# EAGLE schematic haasoscope_pro_fpga_board - power and fanout (EAGLE 9.6.2)

## Sheet 1 of 3
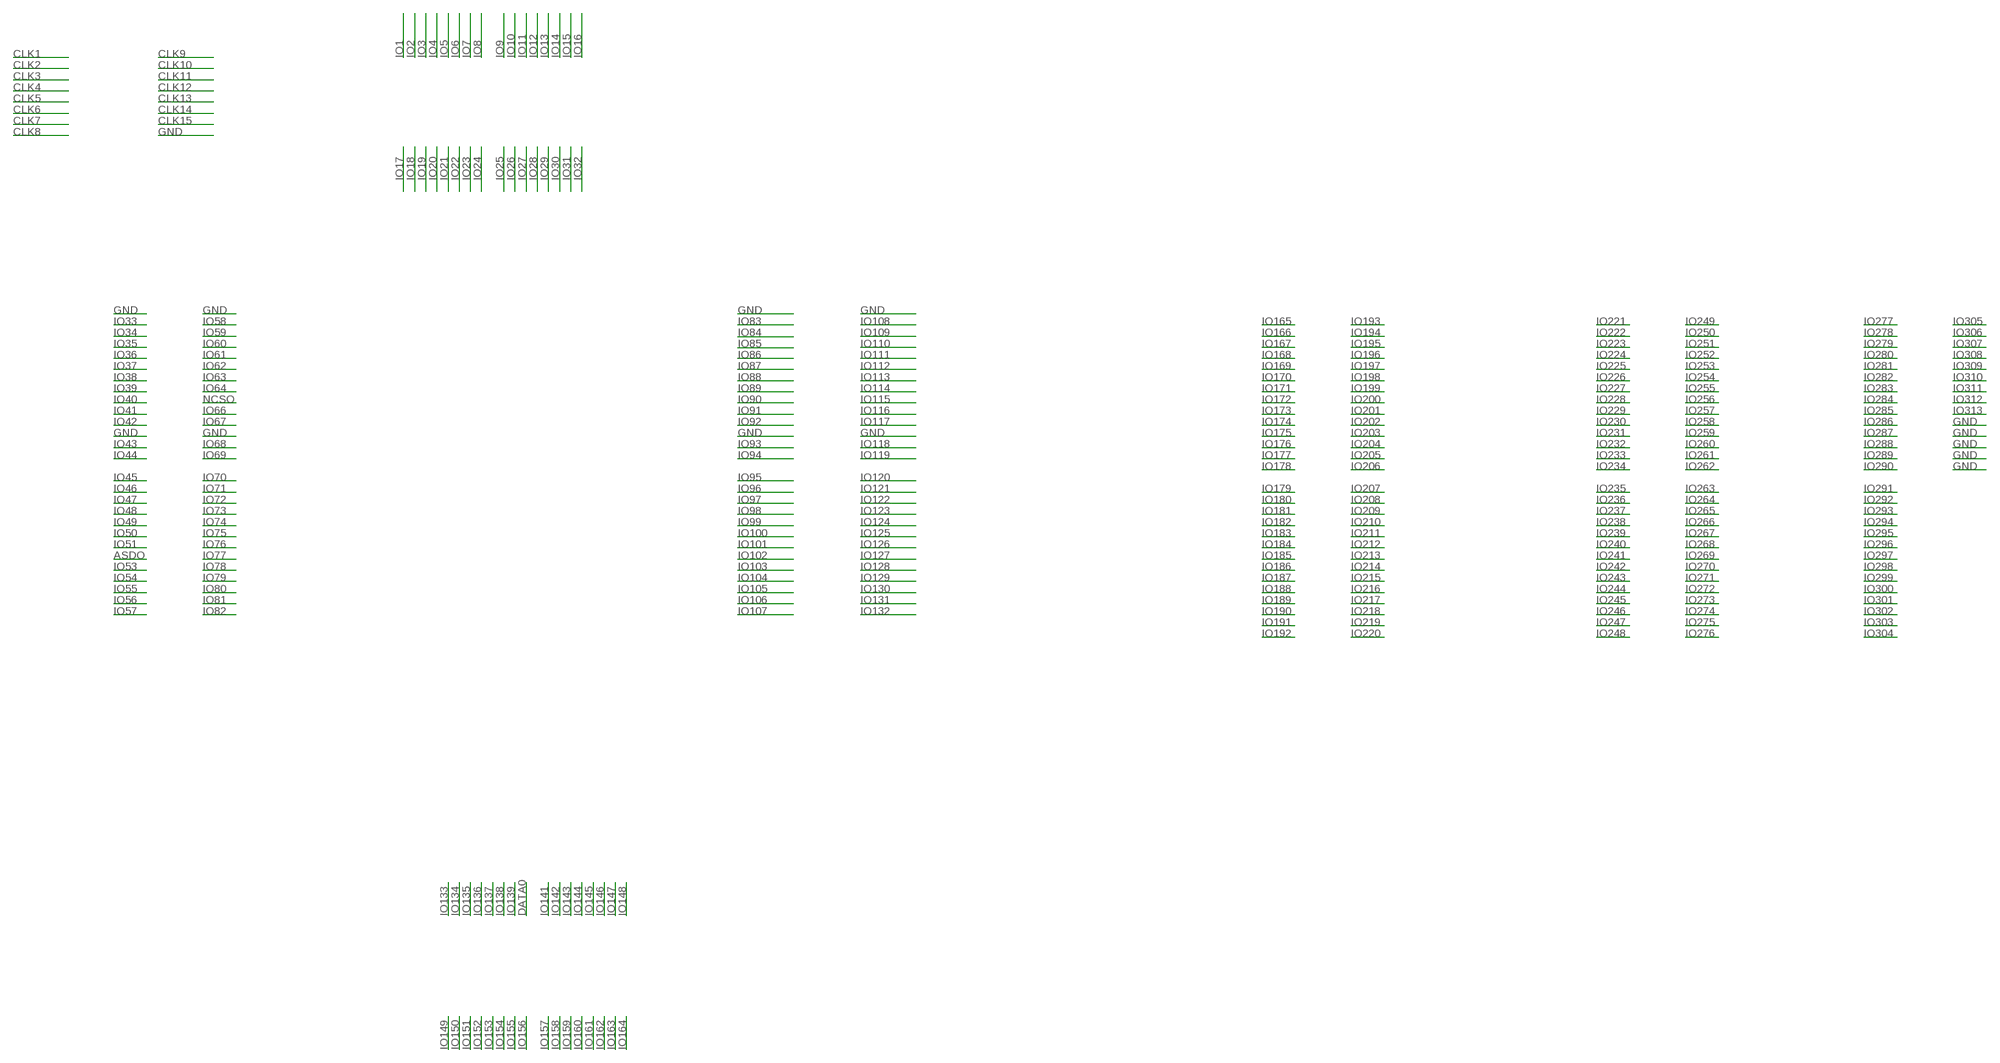
[diagram p0: schematic, sheet 1]

## Sheet 2 of 3
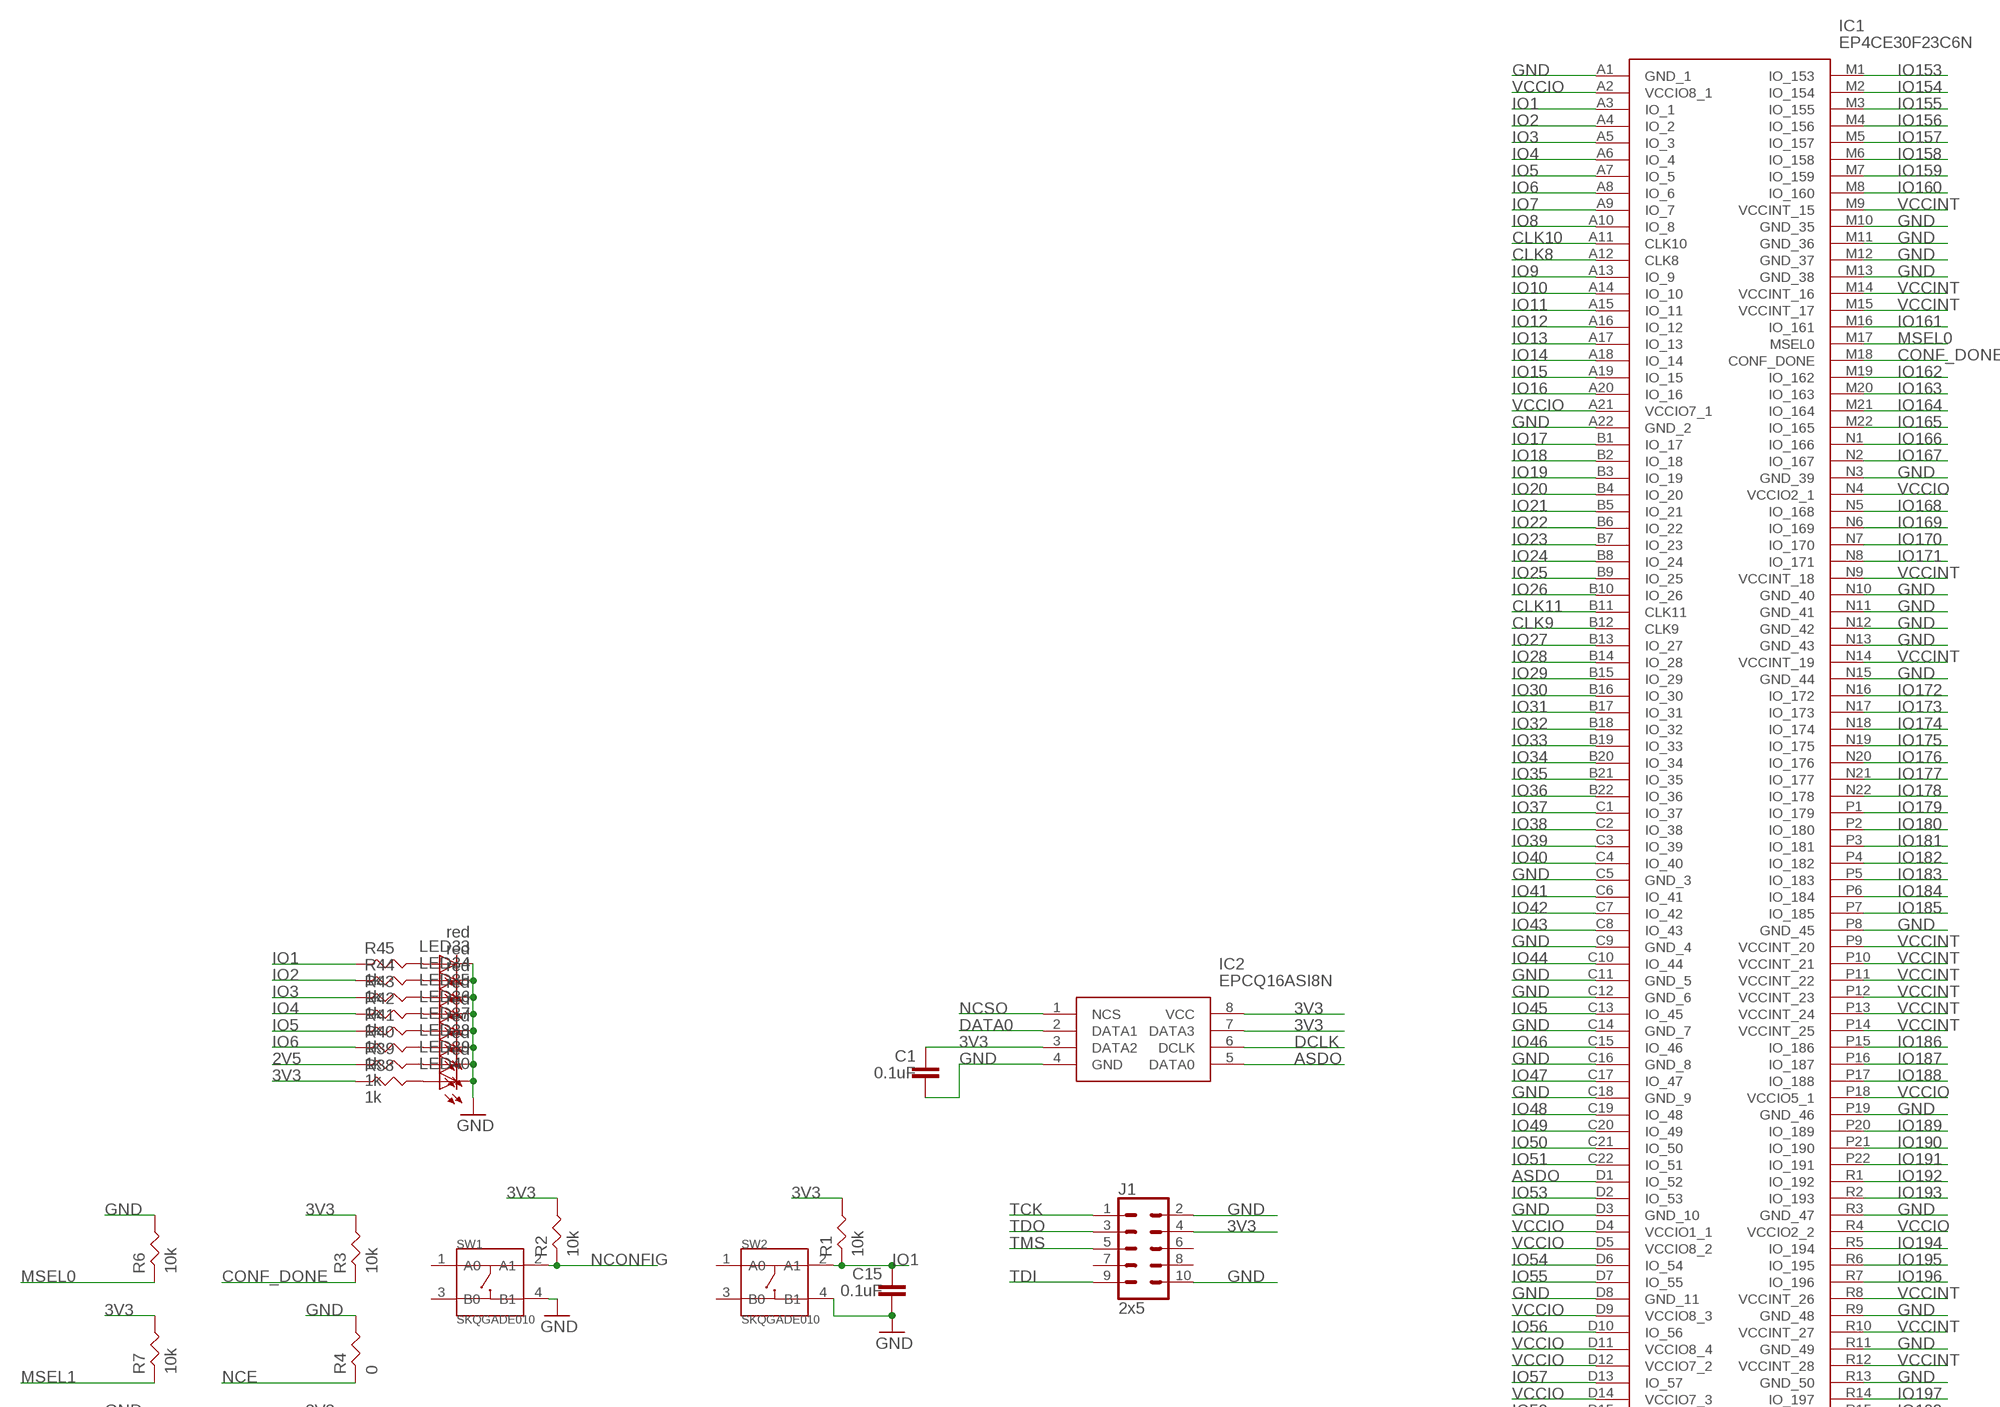
[diagram p1: schematic, sheet 2, part 1 of 2]
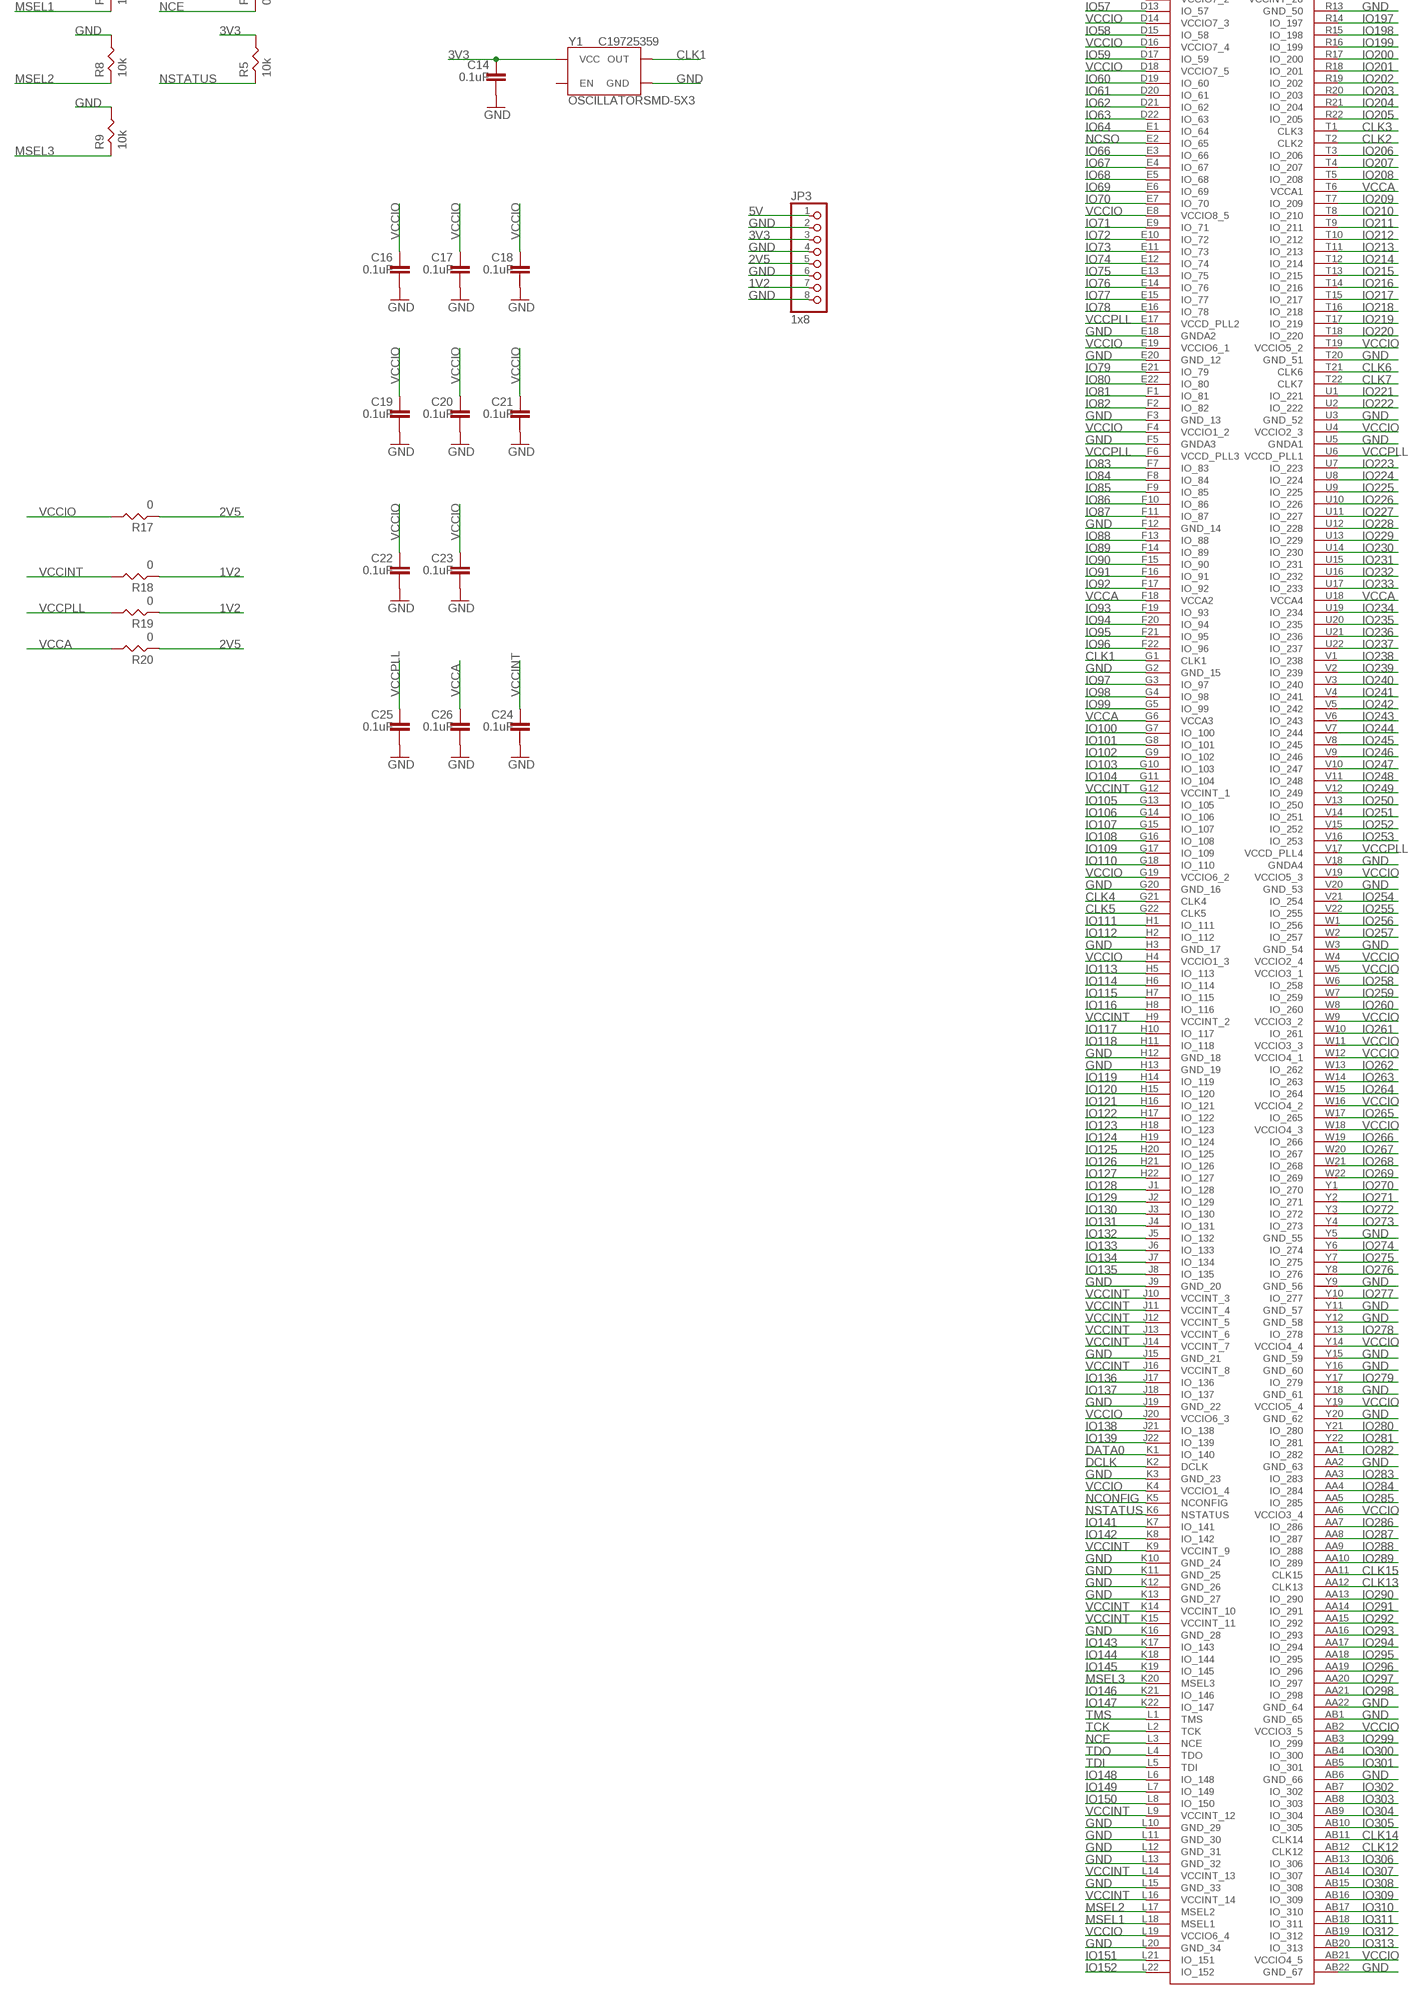
[diagram p2: schematic, sheet 2, part 2 of 2]

### Parts
C1  0.1uF  CAPACITOR_0402_N  [RESC0402_N]
C14  0.1uF  CAPACITOR_0402_N  [RESC0402_N]
C15  0.1uF  CAPACITOR_0402_N  [RESC0402_N]
C16  0.1uF  CAPACITOR_0402_N  [RESC0402_N]
C17  0.1uF  CAPACITOR_0402_N  [RESC0402_N]
C18  0.1uF  CAPACITOR_0402_N  [RESC0402_N]
C19  0.1uF  CAPACITOR_0402_N  [RESC0402_N]
C20  0.1uF  CAPACITOR_0402_N  [RESC0402_N]
C21  0.1uF  CAPACITOR_0402_N  [RESC0402_N]
C22  0.1uF  CAPACITOR_0402_N  [RESC0402_N]
C23  0.1uF  CAPACITOR_0402_N  [RESC0402_N]
C24  0.1uF  CAPACITOR_0402_N  [RESC0402_N]
C25  0.1uF  CAPACITOR_0402_N  [RESC0402_N]
C26  0.1uF  CAPACITOR_0402_N  [RESC0402_N]
IC1  EP4CE30F23C6N  [BGA484C100P22X22_2300X2300X240]
IC2  EPCQ16ASI8N  [SOIC127P600X175-8N]
J1  2x5  CONN_05X2SHD  [2X5-SHROUDED]
JP3  1x8  PINHD-1X8  [1X08]
LED33  red  LEDCHIP-LED0603  [CHIP-LED0603]
LED34  red  LEDCHIP-LED0603  [CHIP-LED0603]
LED35  red  LEDCHIP-LED0603  [CHIP-LED0603]
LED36  red  LEDCHIP-LED0603  [CHIP-LED0603]
LED37  red  LEDCHIP-LED0603  [CHIP-LED0603]
LED38  red  LEDCHIP-LED0603  [CHIP-LED0603]
LED39  red  LEDCHIP-LED0603  [CHIP-LED0603]
LED40  red  LEDCHIP-LED0603  [CHIP-LED0603]
R1  10k  RES-0402  [RES-0402]
R2  10k  RES-0402  [RES-0402]
R3  10k  RES-0402  [RES-0402]
R4  0  RES-0402  [RES-0402]
R5  10k  RES-0402  [RES-0402]
R6  10k  RES-0402  [RES-0402]
R7  10k  RES-0402  [RES-0402]
R8  10k  RES-0402  [RES-0402]
R9  10k  RES-0402  [RES-0402]
R17  0  RES-0402  [RES-0402]
R18  0  RES-0402  [RES-0402]
R19  0  RES-0402  [RES-0402]
R20  0  RES-0402  [RES-0402]
R38  1k  RES-0402  [RES-0402]
R39  1k  RES-0402  [RES-0402]
R40  1k  RES-0402  [RES-0402]
R41  1k  RES-0402  [RES-0402]
R42  1k  RES-0402  [RES-0402]
R43  1k  RES-0402  [RES-0402]
R44  1k  RES-0402  [RES-0402]
R45  1k  RES-0402  [RES-0402]
SW1  SKQGADE010  SMD-BUTTON(4P-5.2X5.2X1.5MM-SKQGADE010)-SKQGADE010  [SW4-SMD-5.2X5.2X1.5MM]
SW2  SKQGADE010  SMD-BUTTON(4P-5.2X5.2X1.5MM-SKQGADE010)-SKQGADE010  [SW4-SMD-5.2X5.2X1.5MM]
Y1  OSCILLATORSMD-5X3  [OSCILLATOR-SMD-5X3.2]

### Nets
1V2 [power]: JP3.7 R18.P$1 R19.P$1 ; also sheet 3
2V5 [power]: JP3.5 R17.P$1 R20.P$1 R39.P$1 ; also sheet 3
3V3 [power]: C1.2 C14.2 IC2.3(DATA2) IC2.7(DATA3) IC2.8(VCC) J1.4 JP3.3 R1.P$2 R2.P$2 R3.P$2 R5.P$2 R7.P$2 R38.P$1 Y1.4(VCC) ; also sheet 3
5V [power]: JP3.1 ; also sheet 3
ASDO: IC1.D1(IO_52) IC2.5(DATA0) ; also sheet 1
CLK1: IC1.G1(CLK1) Y1.3(OUT) ; also sheet 1
CLK2: IC1.T2(CLK2) ; also sheet 1
CLK3: IC1.T1(CLK3) ; also sheet 1
CLK4: IC1.G21(CLK4) ; also sheet 1
CLK5: IC1.G22(CLK5) ; also sheet 1
CLK6: IC1.T21(CLK6) ; also sheet 1
CLK7: IC1.T22(CLK7) ; also sheet 1
CLK8: IC1.A12(CLK8) ; also sheet 1
CLK9: IC1.B12(CLK9) ; also sheet 1
CLK10: IC1.A11(CLK10) ; also sheet 1
CLK11: IC1.B11(CLK11) ; also sheet 1
CLK12: IC1.AB12(CLK12) ; also sheet 1
CLK13: IC1.AA12(CLK13) ; also sheet 1
CLK14: IC1.AB11(CLK14) ; also sheet 1
CLK15: IC1.AA11(CLK15) ; also sheet 1
CONF_DONE: IC1.M18(CONF_DONE) R3.P$1
DATA0: IC1.K1(IO_140) IC2.2(DATA1) ; also sheet 1
DCLK: IC1.K2(DCLK) IC2.6(DCLK)
GND [power]: C1.1 C14.1 C15.1 C16.1 C17.1 C18.1 C19.1 C20.1 C21.1 C22.1 C23.1 C24.1 C25.1 C26.1 IC1.A1(GND_1) IC1.A22(GND_2) IC1.AA2(GND_63) IC1.AA22(GND_64) IC1.AB1(GND_65) IC1.AB6(GND_66) IC1.AB22(GND_67) IC1.C5(GND_3) IC1.C9(GND_4) IC1.C11(GND_5) IC1.C12(GND_6) IC1.C14(GND_7) IC1.C16(GND_8) IC1.C18(GND_9) IC1.D3(GND_10) IC1.D8(GND_11) IC1.E18(GNDA2) IC1.E20(GND_12) IC1.F3(GND_13) IC1.F5(GNDA3) IC1.F12(GND_14) IC1.G2(GND_15) IC1.G20(GND_16) IC1.H3(GND_17) IC1.H12(GND_18) IC1.H13(GND_19) IC1.J9(GND_20) IC1.J15(GND_21) IC1.J19(GND_22) IC1.K3(GND_23) IC1.K10(GND_24) IC1.K11(GND_25) IC1.K12(GND_26) IC1.K13(GND_27) IC1.K16(GND_28) IC1.L10(GND_29) IC1.L11(GND_30) IC1.L12(GND_31) IC1.L13(GND_32) IC1.L15(GND_33) IC1.L20(GND_34) IC1.M10(GND_35) IC1.M11(GND_36) IC1.M12(GND_37) IC1.M13(GND_38) IC1.N3(GND_39) IC1.N10(GND_40) IC1.N11(GND_41) IC1.N12(GND_42) IC1.N13(GND_43) IC1.N15(GND_44) IC1.P8(GND_45) IC1.P19(GND_46) IC1.R3(GND_47) IC1.R9(GND_48) IC1.R11(GND_49) IC1.R13(GND_50) IC1.T20(GND_51) IC1.U3(GND_52) IC1.U5(GNDA1) IC1.V18(GNDA4) IC1.V20(GND_53) IC1.W3(GND_54) IC1.Y5(GND_55) IC1.Y9(GND_56) IC1.Y11(GND_57) IC1.Y12(GND_58) IC1.Y15(GND_59) IC1.Y16(GND_60) IC1.Y18(GND_61) IC1.Y20(GND_62) IC2.4(GND) J1.2 J1.10 JP3.2 JP3.4 JP3.6 JP3.8 LED33.C LED34.C LED35.C LED36.C LED37.C LED38.C LED39.C LED40.C R4.P$2 R6.P$2 R8.P$2 R9.P$2 SW1.4(B1) SW2.4(B1) Y1.2(GND) ; also sheet 1,3
IO1: C15.2 IC1.A3(IO_1) R1.P$1 R45.P$1 SW2.2(A1) ; also sheet 1
IO2: IC1.A4(IO_2) R44.P$1 ; also sheet 1
IO3: IC1.A5(IO_3) R43.P$1 ; also sheet 1
IO4: IC1.A6(IO_4) R42.P$1 ; also sheet 1
IO5: IC1.A7(IO_5) R41.P$1 ; also sheet 1
IO6: IC1.A8(IO_6) R40.P$1 ; also sheet 1
IO7: IC1.A9(IO_7) ; also sheet 1
IO8: IC1.A10(IO_8) ; also sheet 1
IO9: IC1.A13(IO_9) ; also sheet 1
IO10: IC1.A14(IO_10) ; also sheet 1
IO11: IC1.A15(IO_11) ; also sheet 1
IO12: IC1.A16(IO_12) ; also sheet 1
IO13: IC1.A17(IO_13) ; also sheet 1
IO14: IC1.A18(IO_14) ; also sheet 1
IO15: IC1.A19(IO_15) ; also sheet 1
IO16: IC1.A20(IO_16) ; also sheet 1
IO17: IC1.B1(IO_17) ; also sheet 1
IO18: IC1.B2(IO_18) ; also sheet 1
IO19: IC1.B3(IO_19) ; also sheet 1
IO20: IC1.B4(IO_20) ; also sheet 1
IO21: IC1.B5(IO_21) ; also sheet 1
IO22: IC1.B6(IO_22) ; also sheet 1
IO23: IC1.B7(IO_23) ; also sheet 1
IO24: IC1.B8(IO_24) ; also sheet 1
IO25: IC1.B9(IO_25) ; also sheet 1
IO26: IC1.B10(IO_26) ; also sheet 1
IO27: IC1.B13(IO_27) ; also sheet 1
IO28: IC1.B14(IO_28) ; also sheet 1
IO29: IC1.B15(IO_29) ; also sheet 1
IO30: IC1.B16(IO_30) ; also sheet 1
IO31: IC1.B17(IO_31) ; also sheet 1
IO32: IC1.B18(IO_32) ; also sheet 1
IO33: IC1.B19(IO_33) ; also sheet 1
IO34: IC1.B20(IO_34) ; also sheet 1
IO35: IC1.B21(IO_35) ; also sheet 1
IO36: IC1.B22(IO_36) ; also sheet 1
IO37: IC1.C1(IO_37) ; also sheet 1
IO38: IC1.C2(IO_38) ; also sheet 1
IO39: IC1.C3(IO_39) ; also sheet 1
IO40: IC1.C4(IO_40) ; also sheet 1
IO41: IC1.C6(IO_41) ; also sheet 1
IO42: IC1.C7(IO_42) ; also sheet 1
IO43: IC1.C8(IO_43) ; also sheet 1
IO44: IC1.C10(IO_44) ; also sheet 1
IO45: IC1.C13(IO_45) ; also sheet 1
IO46: IC1.C15(IO_46) ; also sheet 1
IO47: IC1.C17(IO_47) ; also sheet 1
IO48: IC1.C19(IO_48) ; also sheet 1
IO49: IC1.C20(IO_49) ; also sheet 1
IO50: IC1.C21(IO_50) ; also sheet 1
IO51: IC1.C22(IO_51) ; also sheet 1
IO53: IC1.D2(IO_53) ; also sheet 1
IO54: IC1.D6(IO_54) ; also sheet 1
IO55: IC1.D7(IO_55) ; also sheet 1
IO56: IC1.D10(IO_56) ; also sheet 1
IO57: IC1.D13(IO_57) ; also sheet 1
IO58: IC1.D15(IO_58) ; also sheet 1
IO59: IC1.D17(IO_59) ; also sheet 1
IO60: IC1.D19(IO_60) ; also sheet 1
IO61: IC1.D20(IO_61) ; also sheet 1
IO62: IC1.D21(IO_62) ; also sheet 1
IO63: IC1.D22(IO_63) ; also sheet 1
IO64: IC1.E1(IO_64) ; also sheet 1
IO66: IC1.E3(IO_66) ; also sheet 1
IO67: IC1.E4(IO_67) ; also sheet 1
IO68: IC1.E5(IO_68) ; also sheet 1
IO69: IC1.E6(IO_69) ; also sheet 1
IO70: IC1.E7(IO_70) ; also sheet 1
IO71: IC1.E9(IO_71) ; also sheet 1
IO72: IC1.E10(IO_72) ; also sheet 1
IO73: IC1.E11(IO_73) ; also sheet 1
IO74: IC1.E12(IO_74) ; also sheet 1
IO75: IC1.E13(IO_75) ; also sheet 1
IO76: IC1.E14(IO_76) ; also sheet 1
IO77: IC1.E15(IO_77) ; also sheet 1
IO78: IC1.E16(IO_78) ; also sheet 1
IO79: IC1.E21(IO_79) ; also sheet 1
IO80: IC1.E22(IO_80) ; also sheet 1
IO81: IC1.F1(IO_81) ; also sheet 1
IO82: IC1.F2(IO_82) ; also sheet 1
IO83: IC1.F7(IO_83) ; also sheet 1
IO84: IC1.F8(IO_84) ; also sheet 1
IO85: IC1.F9(IO_85) ; also sheet 1
IO86: IC1.F10(IO_86) ; also sheet 1
IO87: IC1.F11(IO_87) ; also sheet 1
IO88: IC1.F13(IO_88) ; also sheet 1
IO89: IC1.F14(IO_89) ; also sheet 1
IO90: IC1.F15(IO_90) ; also sheet 1
IO91: IC1.F16(IO_91) ; also sheet 1
IO92: IC1.F17(IO_92) ; also sheet 1
IO93: IC1.F19(IO_93) ; also sheet 1
IO94: IC1.F20(IO_94) ; also sheet 1
IO95: IC1.F21(IO_95) ; also sheet 1
IO96: IC1.F22(IO_96) ; also sheet 1
IO97: IC1.G3(IO_97) ; also sheet 1
IO98: IC1.G4(IO_98) ; also sheet 1
IO99: IC1.G5(IO_99) ; also sheet 1
IO100: IC1.G7(IO_100) ; also sheet 1
IO101: IC1.G8(IO_101) ; also sheet 1
IO102: IC1.G9(IO_102) ; also sheet 1
IO103: IC1.G10(IO_103) ; also sheet 1
IO104: IC1.G11(IO_104) ; also sheet 1
IO105: IC1.G13(IO_105) ; also sheet 1
IO106: IC1.G14(IO_106) ; also sheet 1
IO107: IC1.G15(IO_107) ; also sheet 1
IO108: IC1.G16(IO_108) ; also sheet 1
IO109: IC1.G17(IO_109) ; also sheet 1
IO110: IC1.G18(IO_110) ; also sheet 1
IO111: IC1.H1(IO_111) ; also sheet 1
IO112: IC1.H2(IO_112) ; also sheet 1
IO113: IC1.H5(IO_113) ; also sheet 1
IO114: IC1.H6(IO_114) ; also sheet 1
IO115: IC1.H7(IO_115) ; also sheet 1
IO116: IC1.H8(IO_116) ; also sheet 1
IO117: IC1.H10(IO_117) ; also sheet 1
IO118: IC1.H11(IO_118) ; also sheet 1
IO119: IC1.H14(IO_119) ; also sheet 1
IO120: IC1.H15(IO_120) ; also sheet 1
IO121: IC1.H16(IO_121) ; also sheet 1
IO122: IC1.H17(IO_122) ; also sheet 1
IO123: IC1.H18(IO_123) ; also sheet 1
IO124: IC1.H19(IO_124) ; also sheet 1
IO125: IC1.H20(IO_125) ; also sheet 1
IO126: IC1.H21(IO_126) ; also sheet 1
IO127: IC1.H22(IO_127) ; also sheet 1
IO128: IC1.J1(IO_128) ; also sheet 1
IO129: IC1.J2(IO_129) ; also sheet 1
IO130: IC1.J3(IO_130) ; also sheet 1
IO131: IC1.J4(IO_131) ; also sheet 1
IO132: IC1.J5(IO_132) ; also sheet 1
IO133: IC1.J6(IO_133) ; also sheet 1
IO134: IC1.J7(IO_134) ; also sheet 1
IO135: IC1.J8(IO_135) ; also sheet 1
IO136: IC1.J17(IO_136) ; also sheet 1
IO137: IC1.J18(IO_137) ; also sheet 1
IO138: IC1.J21(IO_138) ; also sheet 1
IO139: IC1.J22(IO_139) ; also sheet 1
IO141: IC1.K7(IO_141) ; also sheet 1
IO142: IC1.K8(IO_142) ; also sheet 1
IO143: IC1.K17(IO_143) ; also sheet 1
IO144: IC1.K18(IO_144) ; also sheet 1
IO145: IC1.K19(IO_145) ; also sheet 1
IO146: IC1.K21(IO_146) ; also sheet 1
IO147: IC1.K22(IO_147) ; also sheet 1
IO148: IC1.L6(IO_148) ; also sheet 1
IO149: IC1.L7(IO_149) ; also sheet 1
IO150: IC1.L8(IO_150) ; also sheet 1
IO151: IC1.L21(IO_151) ; also sheet 1
IO152: IC1.L22(IO_152) ; also sheet 1
IO153: IC1.M1(IO_153) ; also sheet 1
IO154: IC1.M2(IO_154) ; also sheet 1
IO155: IC1.M3(IO_155) ; also sheet 1
IO156: IC1.M4(IO_156) ; also sheet 1
IO157: IC1.M5(IO_157) ; also sheet 1
IO158: IC1.M6(IO_158) ; also sheet 1
IO159: IC1.M7(IO_159) ; also sheet 1
IO160: IC1.M8(IO_160) ; also sheet 1
IO161: IC1.M16(IO_161) ; also sheet 1
IO162: IC1.M19(IO_162) ; also sheet 1
IO163: IC1.M20(IO_163) ; also sheet 1
IO164: IC1.M21(IO_164) ; also sheet 1
IO165: IC1.M22(IO_165) ; also sheet 1
IO166: IC1.N1(IO_166) ; also sheet 1
IO167: IC1.N2(IO_167) ; also sheet 1
IO168: IC1.N5(IO_168) ; also sheet 1
IO169: IC1.N6(IO_169) ; also sheet 1
IO170: IC1.N7(IO_170) ; also sheet 1
IO171: IC1.N8(IO_171) ; also sheet 1
IO172: IC1.N16(IO_172) ; also sheet 1
IO173: IC1.N17(IO_173) ; also sheet 1
IO174: IC1.N18(IO_174) ; also sheet 1
IO175: IC1.N19(IO_175) ; also sheet 1
IO176: IC1.N20(IO_176) ; also sheet 1
IO177: IC1.N21(IO_177) ; also sheet 1
IO178: IC1.N22(IO_178) ; also sheet 1
IO179: IC1.P1(IO_179) ; also sheet 1
IO180: IC1.P2(IO_180) ; also sheet 1
IO181: IC1.P3(IO_181) ; also sheet 1
IO182: IC1.P4(IO_182) ; also sheet 1
IO183: IC1.P5(IO_183) ; also sheet 1
IO184: IC1.P6(IO_184) ; also sheet 1
IO185: IC1.P7(IO_185) ; also sheet 1
IO186: IC1.P15(IO_186) ; also sheet 1
IO187: IC1.P16(IO_187) ; also sheet 1
IO188: IC1.P17(IO_188) ; also sheet 1
IO189: IC1.P20(IO_189) ; also sheet 1
IO190: IC1.P21(IO_190) ; also sheet 1
IO191: IC1.P22(IO_191) ; also sheet 1
IO192: IC1.R1(IO_192) ; also sheet 1
IO193: IC1.R2(IO_193) ; also sheet 1
IO194: IC1.R5(IO_194) ; also sheet 1
IO195: IC1.R6(IO_195) ; also sheet 1
IO196: IC1.R7(IO_196) ; also sheet 1
IO197: IC1.R14(IO_197) ; also sheet 1
IO198: IC1.R15(IO_198) ; also sheet 1
IO199: IC1.R16(IO_199) ; also sheet 1
IO200: IC1.R17(IO_200) ; also sheet 1
IO201: IC1.R18(IO_201) ; also sheet 1
IO202: IC1.R19(IO_202) ; also sheet 1
IO203: IC1.R20(IO_203) ; also sheet 1
IO204: IC1.R21(IO_204) ; also sheet 1
IO205: IC1.R22(IO_205) ; also sheet 1
IO206: IC1.T3(IO_206) ; also sheet 1
IO207: IC1.T4(IO_207) ; also sheet 1
IO208: IC1.T5(IO_208) ; also sheet 1
IO209: IC1.T7(IO_209) ; also sheet 1
IO210: IC1.T8(IO_210) ; also sheet 1
IO211: IC1.T9(IO_211) ; also sheet 1
IO212: IC1.T10(IO_212) ; also sheet 1
IO213: IC1.T11(IO_213) ; also sheet 1
IO214: IC1.T12(IO_214) ; also sheet 1
IO215: IC1.T13(IO_215) ; also sheet 1
IO216: IC1.T14(IO_216) ; also sheet 1
IO217: IC1.T15(IO_217) ; also sheet 1
IO218: IC1.T16(IO_218) ; also sheet 1
IO219: IC1.T17(IO_219) ; also sheet 1
IO220: IC1.T18(IO_220) ; also sheet 1
IO221: IC1.U1(IO_221) ; also sheet 1
IO222: IC1.U2(IO_222) ; also sheet 1
IO223: IC1.U7(IO_223) ; also sheet 1
IO224: IC1.U8(IO_224) ; also sheet 1
IO225: IC1.U9(IO_225) ; also sheet 1
IO226: IC1.U10(IO_226) ; also sheet 1
IO227: IC1.U11(IO_227) ; also sheet 1
IO228: IC1.U12(IO_228) ; also sheet 1
IO229: IC1.U13(IO_229) ; also sheet 1
IO230: IC1.U14(IO_230) ; also sheet 1
IO231: IC1.U15(IO_231) ; also sheet 1
IO232: IC1.U16(IO_232) ; also sheet 1
IO233: IC1.U17(IO_233) ; also sheet 1
IO234: IC1.U19(IO_234) ; also sheet 1
IO235: IC1.U20(IO_235) ; also sheet 1
IO236: IC1.U21(IO_236) ; also sheet 1
IO237: IC1.U22(IO_237) ; also sheet 1
IO238: IC1.V1(IO_238) ; also sheet 1
IO239: IC1.V2(IO_239) ; also sheet 1
IO240: IC1.V3(IO_240) ; also sheet 1
IO241: IC1.V4(IO_241) ; also sheet 1
IO242: IC1.V5(IO_242) ; also sheet 1
IO243: IC1.V6(IO_243) ; also sheet 1
IO244: IC1.V7(IO_244) ; also sheet 1
IO245: IC1.V8(IO_245) ; also sheet 1
IO246: IC1.V9(IO_246) ; also sheet 1
IO247: IC1.V10(IO_247) ; also sheet 1
IO248: IC1.V11(IO_248) ; also sheet 1
IO249: IC1.V12(IO_249) ; also sheet 1
IO250: IC1.V13(IO_250) ; also sheet 1
IO251: IC1.V14(IO_251) ; also sheet 1
IO252: IC1.V15(IO_252) ; also sheet 1
IO253: IC1.V16(IO_253) ; also sheet 1
IO254: IC1.V21(IO_254) ; also sheet 1
IO255: IC1.V22(IO_255) ; also sheet 1
IO256: IC1.W1(IO_256) ; also sheet 1
IO257: IC1.W2(IO_257) ; also sheet 1
IO258: IC1.W6(IO_258) ; also sheet 1
IO259: IC1.W7(IO_259) ; also sheet 1
IO260: IC1.W8(IO_260) ; also sheet 1
IO261: IC1.W10(IO_261) ; also sheet 1
IO262: IC1.W13(IO_262) ; also sheet 1
IO263: IC1.W14(IO_263) ; also sheet 1
IO264: IC1.W15(IO_264) ; also sheet 1
IO265: IC1.W17(IO_265) ; also sheet 1
IO266: IC1.W19(IO_266) ; also sheet 1
IO267: IC1.W20(IO_267) ; also sheet 1
IO268: IC1.W21(IO_268) ; also sheet 1
IO269: IC1.W22(IO_269) ; also sheet 1
IO270: IC1.Y1(IO_270) ; also sheet 1
IO271: IC1.Y2(IO_271) ; also sheet 1
IO272: IC1.Y3(IO_272) ; also sheet 1
IO273: IC1.Y4(IO_273) ; also sheet 1
IO274: IC1.Y6(IO_274) ; also sheet 1
IO275: IC1.Y7(IO_275) ; also sheet 1
IO276: IC1.Y8(IO_276) ; also sheet 1
IO277: IC1.Y10(IO_277) ; also sheet 1
IO278: IC1.Y13(IO_278) ; also sheet 1
IO279: IC1.Y17(IO_279) ; also sheet 1
IO280: IC1.Y21(IO_280) ; also sheet 1
IO281: IC1.Y22(IO_281) ; also sheet 1
IO282: IC1.AA1(IO_282) ; also sheet 1
IO283: IC1.AA3(IO_283) ; also sheet 1
IO284: IC1.AA4(IO_284) ; also sheet 1
IO285: IC1.AA5(IO_285) ; also sheet 1
IO286: IC1.AA7(IO_286) ; also sheet 1
IO287: IC1.AA8(IO_287) ; also sheet 1
IO288: IC1.AA9(IO_288) ; also sheet 1
IO289: IC1.AA10(IO_289) ; also sheet 1
IO290: IC1.AA13(IO_290) ; also sheet 1
IO291: IC1.AA14(IO_291) ; also sheet 1
IO292: IC1.AA15(IO_292) ; also sheet 1
IO293: IC1.AA16(IO_293) ; also sheet 1
IO294: IC1.AA17(IO_294) ; also sheet 1
IO295: IC1.AA18(IO_295) ; also sheet 1
IO296: IC1.AA19(IO_296) ; also sheet 1
IO297: IC1.AA20(IO_297) ; also sheet 1
IO298: IC1.AA21(IO_298) ; also sheet 1
IO299: IC1.AB3(IO_299) ; also sheet 1
IO300: IC1.AB4(IO_300) ; also sheet 1
IO301: IC1.AB5(IO_301) ; also sheet 1
IO302: IC1.AB7(IO_302) ; also sheet 1
IO303: IC1.AB8(IO_303) ; also sheet 1
IO304: IC1.AB9(IO_304) ; also sheet 1
IO305: IC1.AB10(IO_305) ; also sheet 1
IO306: IC1.AB13(IO_306) ; also sheet 1
IO307: IC1.AB14(IO_307) ; also sheet 1
IO308: IC1.AB15(IO_308) ; also sheet 1
IO309: IC1.AB16(IO_309) ; also sheet 1
IO310: IC1.AB17(IO_310) ; also sheet 1
IO311: IC1.AB18(IO_311) ; also sheet 1
IO312: IC1.AB19(IO_312) ; also sheet 1
IO313: IC1.AB20(IO_313) ; also sheet 1
MSEL0: IC1.M17(MSEL0) R6.P$1
MSEL1: IC1.L18(MSEL1) R7.P$1
MSEL2: IC1.L17(MSEL2) R8.P$1
MSEL3: IC1.K20(MSEL3) R9.P$1
N$33: LED33.A R45.P$2
N$34: LED34.A R44.P$2
N$35: LED35.A R43.P$2
N$36: LED36.A R42.P$2
N$37: LED37.A R41.P$2
N$38: LED38.A R40.P$2
N$39: LED39.A R39.P$2
N$40: LED40.A R38.P$2
NCE: IC1.L3(NCE) R4.P$1
NCONFIG: IC1.K5(NCONFIG) R2.P$1 SW1.2(A1)
NCSO: IC1.E2(IO_65) IC2.1(NCS) ; also sheet 1
NSTATUS: IC1.K6(NSTATUS) R5.P$1
TCK: IC1.L2(TCK) J1.1
TDI: IC1.L5(TDI) J1.9
TDO: IC1.L4(TDO) J1.3
TMS: IC1.L1(TMS) J1.5
VCCA [power]: C26.2 IC1.F18(VCCA2) IC1.G6(VCCA3) IC1.T6(VCCA1) IC1.U18(VCCA4) R20.P$2
VCCINT [power]: C24.2 IC1.G12(VCCINT_1) IC1.H9(VCCINT_2) IC1.J10(VCCINT_3) IC1.J11(VCCINT_4) IC1.J12(VCCINT_5) IC1.J13(VCCINT_6) IC1.J14(VCCINT_7) IC1.J16(VCCINT_8) IC1.K9(VCCINT_9) IC1.K14(VCCINT_10) IC1.K15(VCCINT_11) IC1.L9(VCCINT_12) IC1.L14(VCCINT_13) IC1.L16(VCCINT_14) IC1.M9(VCCINT_15) IC1.M14(VCCINT_16) IC1.M15(VCCINT_17) IC1.N9(VCCINT_18) IC1.N14(VCCINT_19) IC1.P9(VCCINT_20) IC1.P10(VCCINT_21) IC1.P11(VCCINT_22) IC1.P12(VCCINT_23) IC1.P13(VCCINT_24) IC1.P14(VCCINT_25) IC1.R8(VCCINT_26) IC1.R10(VCCINT_27) IC1.R12(VCCINT_28) R18.P$2
VCCIO: C16.2 C17.2 C18.2 C19.2 C20.2 C21.2 C22.2 C23.2 IC1.A2(VCCIO8_1) IC1.A21(VCCIO7_1) IC1.AA6(VCCIO3_4) IC1.AB2(VCCIO3_5) IC1.AB21(VCCIO4_5) IC1.D4(VCCIO1_1) IC1.D5(VCCIO8_2) IC1.D9(VCCIO8_3) IC1.D11(VCCIO8_4) IC1.D12(VCCIO7_2) IC1.D14(VCCIO7_3) IC1.D16(VCCIO7_4) IC1.D18(VCCIO7_5) IC1.E8(VCCIO8_5) IC1.E19(VCCIO6_1) IC1.F4(VCCIO1_2) IC1.G19(VCCIO6_2) IC1.H4(VCCIO1_3) IC1.J20(VCCIO6_3) IC1.K4(VCCIO1_4) IC1.L19(VCCIO6_4) IC1.N4(VCCIO2_1) IC1.P18(VCCIO5_1) IC1.R4(VCCIO2_2) IC1.T19(VCCIO5_2) IC1.U4(VCCIO2_3) IC1.V19(VCCIO5_3) IC1.W4(VCCIO2_4) IC1.W5(VCCIO3_1) IC1.W9(VCCIO3_2) IC1.W11(VCCIO3_3) IC1.W12(VCCIO4_1) IC1.W16(VCCIO4_2) IC1.W18(VCCIO4_3) IC1.Y14(VCCIO4_4) IC1.Y19(VCCIO5_4) R17.P$2
VCCPLL [power]: C25.2 IC1.E17(VCCD_PLL2) IC1.F6(VCCD_PLL3) IC1.U6(VCCD_PLL1) IC1.V17(VCCD_PLL4) R19.P$2
Unconnected: J1.6 J1.7 J1.8 SW1.1(A0) SW1.3(B0) SW2.1(A0) SW2.3(B0) Y1.1(EN)

## Sheet 3 of 3
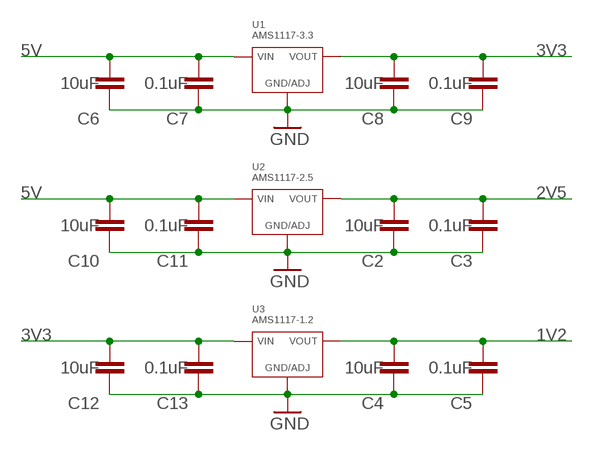
[diagram p3: schematic, sheet 3]

### Parts
C2  10uF  CAPACITOR_0805_N  [RESC0805_N]
C3  0.1uF  CAPACITOR_0402_N  [RESC0402_N]
C4  10uF  CAPACITOR_0805_N  [RESC0805_N]
C5  0.1uF  CAPACITOR_0402_N  [RESC0402_N]
C6  10uF  CAPACITOR_0805_N  [RESC0805_N]
C7  0.1uF  CAPACITOR_0402_N  [RESC0402_N]
C8  10uF  CAPACITOR_0805_N  [RESC0805_N]
C9  0.1uF  CAPACITOR_0402_N  [RESC0402_N]
C10  10uF  CAPACITOR_0805_N  [RESC0805_N]
C11  0.1uF  CAPACITOR_0402_N  [RESC0402_N]
C12  10uF  CAPACITOR_0805_N  [RESC0805_N]
C13  0.1uF  CAPACITOR_0402_N  [RESC0402_N]
U1  AMS1117-3.3  NCP1117LPST33T3G  [SOT-223-3]
U2  AMS1117-2.5  NCP1117LPST33T3G  [SOT-223-3]
U3  AMS1117-1.2  NCP1117LPST33T3G  [SOT-223-3]

### Nets
1V2 [power]: C4.2 C5.2 U3.P$1(VOUT) U3.P$3(VOUT) ; also sheet 2
2V5 [power]: C2.2 C3.2 U2.P$1(VOUT) U2.P$3(VOUT) ; also sheet 2
3V3 [power]: C8.2 C9.2 C12.2 C13.2 U1.P$1(VOUT) U1.P$3(VOUT) U3.P$4(VIN) ; also sheet 2
5V [power]: C6.2 C7.2 C10.2 C11.2 U1.P$4(VIN) U2.P$4(VIN) ; also sheet 2
GND [power]: C2.1 C3.1 C4.1 C5.1 C6.1 C7.1 C8.1 C9.1 C10.1 C11.1 C12.1 C13.1 U1.P$2(GND/ADJ) U2.P$2(GND/ADJ) U3.P$2(GND/ADJ) ; also sheet 1,2

## Library data of the parts
C1-C26 = Nordic_nRF:CAPACITOR: Generic chip capacitor
IC1 = EP4CE30F23C6N:EP4CE30F23C6N: FPGA - Field Programmable Gate Array FPGA - Cyclone IV E 1803 LABs 328 IOs Source: Datasheet; DESCRIPTION: FPGA - Field Programmable Gate Array FPGA - Cyclone IV E 1803 LABs 328 IOs; HEIGHT: 2.4mm; MANUFACTURER_NAME: Intel; MANUFACTURER_PART_NUMBER: EP4CE30F23C6N; MOUSER_PART_NUMBER: 989-EP4CE30F23C6N; MOUSER_PRICE-STOCK: https://www.mouser.co.uk/ProductDetail/Intel-Altera/EP4CE30F23C6N?qs=jblrfmjbeiFbWx2dd1mvzw%3D%3D
IC2 = EPCQ16ASI8N:EPCQ16ASI8N: FPGA - Configuration Memory Source: Datasheet <https://www.altera.com/content/dam/altera-www/global/en_US/pdfs/literature/hb/cfg/cfg_cf52014.pdf>; DESCRIPTION: FPGA - Configuration Memory; HEIGHT: 1.75mm; MANUFACTURER_NAME: Intel; MANUFACTURER_PART_NUMBER: EPCQ16ASI8N; MOUSER_PART_NUMBER: 989-EPCQ16ASI8N; MOUSER_PRICE-STOCK: https://www.mouser.co.uk/ProductDetail/Intel-Altera/EPCQ16ASI8N?qs=EU6FO9ffTwfG9ViUTMZ%252BJw%3D%3D
J1 = SparkFun-Connectors:CONN_05X2: Multi connection point. Often used as Generic Header-pin footprint for 0.1 inch spaced/style header connections For AVR SPI programming port, see special device with nice symbol: "AVR_SPI_PROG_5x2.dev" You can populate with any combo of single row headers, but if you'd like an exact match, check these: 2x5 AVR ICSP Male Header <https://www.sparkfun.com/products/778> (PRT-00778) 2x5 Pin Shrouded Header <https://www.sparkfun.com/products/8506> (PRT-08506) On any of the 0.1 inch spaced packages, you can populate with these: Break Away Headers - Straight <https://www.sparkfun.com/products/116> (PRT-00116) Break Away Male Headers - Right Angle <https://www.sparkfun.com/products/553> (PRT-00553) Female Headers <https://www.sparkfun.com/products/115> (PRT-00115) Break Away Headers - Machine Pin <https://www.sparkfun.com/products/117> (PRT-00117) Break Away Female Headers - Swiss Machine Pin <https://www.sparkfun.com/products/743> (PRT-00743) Special note: the shrouded connector mates well with our 5x2 ribbon cables: 2x5 Pin IDC Ribbon Cable <https://www.sparkfun.com/products/8535> (PRT-08535); PROD_ID: CONN-08671; SF_ID: PRT-08506
JP3 = pinhead:PINHD-1X8: PIN HEADER
LED33-LED40 = adafruit:LED: LED OSRAM: - CHIPLED LG R971, LG N971, LY N971, LG Q971, LY Q971, LO R971, LY R971 LH N974, LH R974 LS Q976, LO Q976, LY Q976 LO Q996 - Hyper CHIPLED LW Q18S LB Q993, LB Q99A, LB R99A - SideLED LS A670, LO A670, LY A670, LG A670, LP A670 LB A673, LV A673, LT A673, LW A673 LH A674 LY A675 LS A676, LA A676, LO A676, LY A676, LW A676 LS A679, LY A679, LG A679 - Hyper Micro SIDELED® LS Y876, LA Y876, LO Y876, LY Y876 LT Y87S - SmartLED LW L88C, LW L88S LB L89C, LB L89S, LG L890 LS L89K, LO L89K, LY L89K LS L896, LA L896, LO L896, LY L896 - TOPLED LS T670, LO T670, LY T670, LG T670, LP T670 LSG T670, LSP T670, LSY T670, LOP T670, LYG T670 LG T671, LOG T671, LSG T671 LB T673, LV T673, LT T673, LW T673 LH T674 LS T676, LA T676, LO T676, LY T676, LB T676, LH T676, LSB T676, LW T676 LB T67C, LV T67C, LT T67C, LS T67K, LO T67K, LY T67K, LW E67C LS E67B, LA E67B, LO E67B, LY E67B, LB E67C, LV E67C, LT E67C LW T67C LS T679, LY T679, LG T679 LS T770, LO T770, LY T770, LG T770, LP T770 LB T773, LV T773, LT T773, LW T773 LH T774 LS E675, LA E675, LY E675, LS T675 LS T776, LA T776, LO T776, LY T776, LB T776 LHGB T686 LT T68C, LB T68C - Hyper Mini TOPLED® LB M676 - Mini TOPLED Santana® LG M470 LS M47K, LO M47K, LY M47K Source: http://www.osram.convergy.de/
R1-R9 R17-R20 R38-R45 = FlashPCB_Resistors:RES-0402: https://www.digikey.com/en/products/filter/chip-resistor-surface-mount/52?s=N4IgjCBcpgbFoDGUBmBDANgZwKYBoQB7KAbRAGYBOAJgBZ4BdAgBwBcoQBlVgJwEsAdgHMQAX1EFqpEDxxY%2BWVoR4gGooA
SW1 SW2 = Seeed-Switch:SMD-BUTTON(4P-5.2X5.2X1.5MM-SKQGADE010): 311020017; MPN: SKQGADE010
U1 = MF_IC_Power:NCP1117LP: Manufacturer Part #: NCP1117LP Manufacturer: ON Semiconductor Description: LDO Voltage Regulators; HOUSEPART: NO; MPN: AMS1117-3.3; POPULATE: 1; URL: http://www.onsemi.com/pub_link/Collateral/NCP1117LP-D.PDF; VALUE: NCP1117LPST33T3G
U2 = MF_IC_Power:NCP1117LP: Manufacturer Part #: NCP1117LP Manufacturer: ON Semiconductor Description: LDO Voltage Regulators; HOUSEPART: NO; MPN: AMS1117-2.5; POPULATE: 1; URL: http://www.onsemi.com/pub_link/Collateral/NCP1117LP-D.PDF; VALUE: NCP1117LPST33T3G
U3 = MF_IC_Power:NCP1117LP: Manufacturer Part #: NCP1117LP Manufacturer: ON Semiconductor Description: LDO Voltage Regulators; HOUSEPART: NO; MPN: AMS1117-1.2; POPULATE: 1; URL: http://www.onsemi.com/pub_link/Collateral/NCP1117LP-D.PDF; VALUE: NCP1117LPST33T3G
Y1 = SparkFun-Clocks:OSCILLATOR: Oscillators (Generic) These are active oscillators, which require a power source to generate their clock output. Most oscillators are configured to generate a set frequency (e.g. 16MHz). They have four pins: power, ground, output, and an enable input.; LCSC: C19725359

## Net classes
0 default: width 0.089 mm
1 power: width 0.152 mm
2 diffpair: width 0.089 mm
3 loosediffpair: width 0.152 mm, clearance 0.305 mm to class 0, clearance 0.305 mm to class 1, clearance 0.305 mm to class 2, clearance 0.305 mm